# EAGLE design revC (EAGLE 6.4)
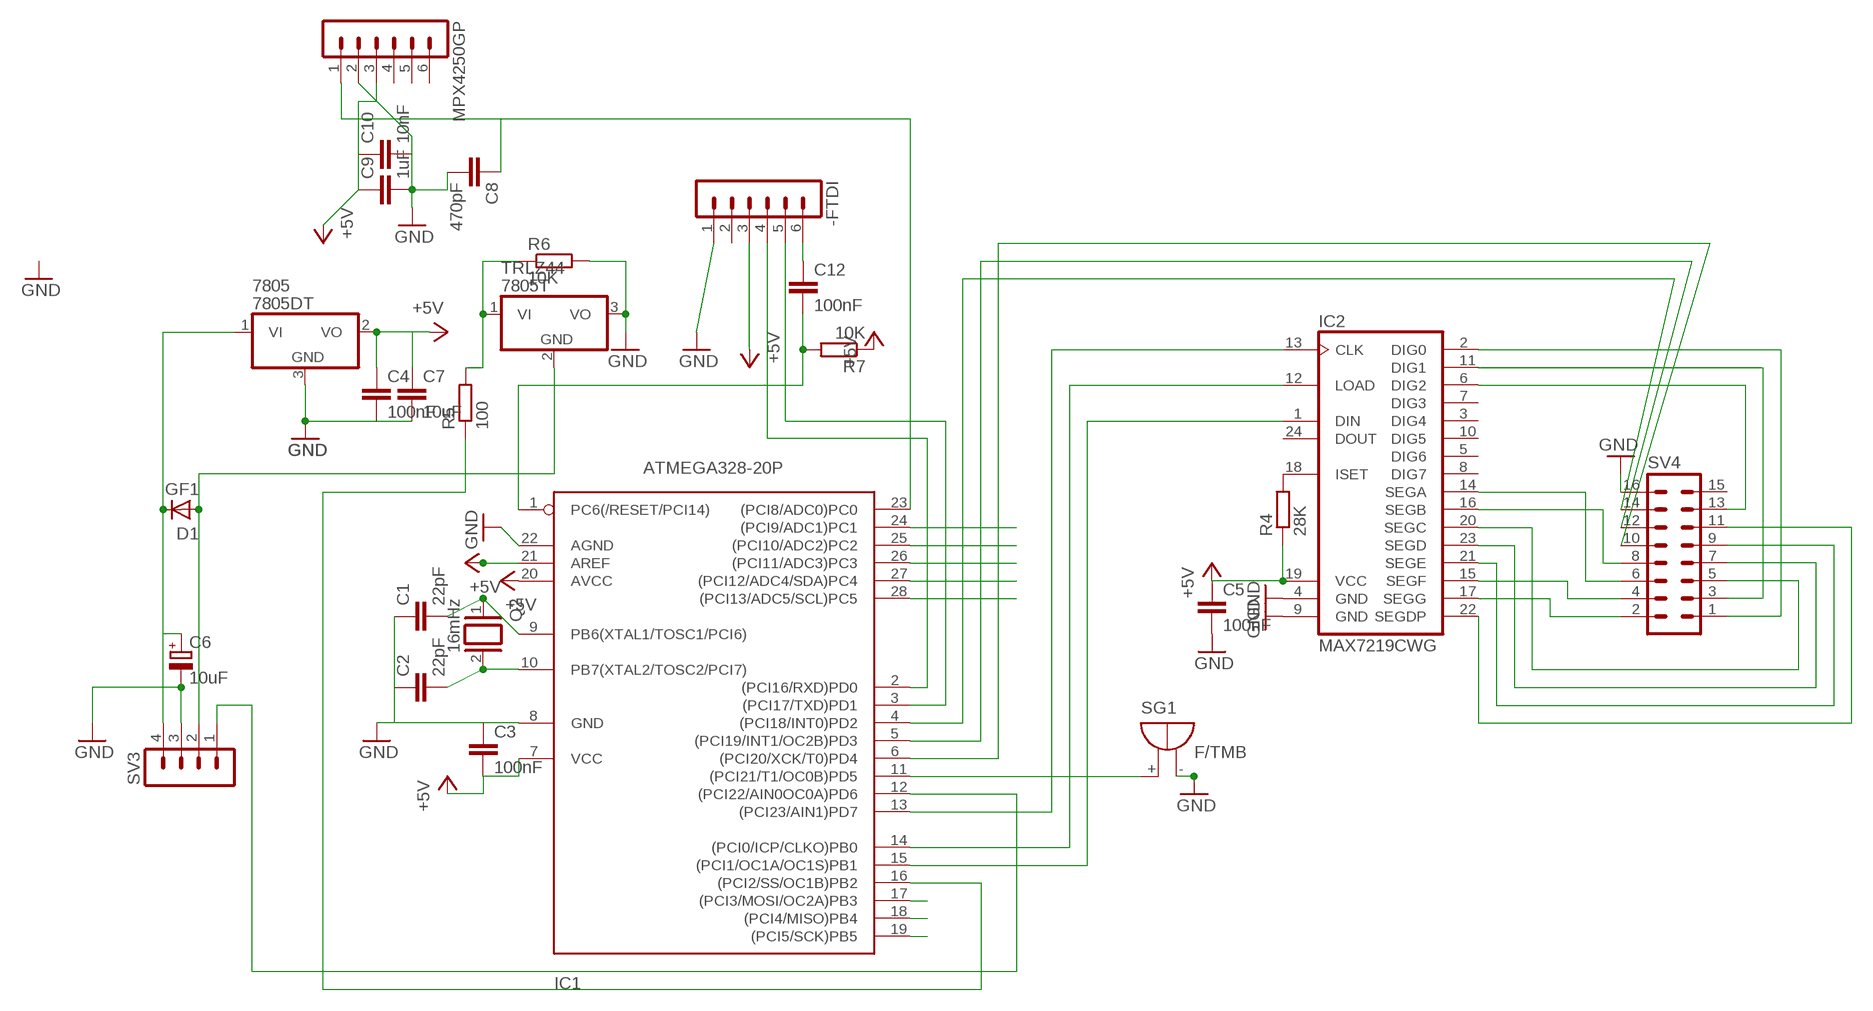
[diagram p0: schematic, sheet 1]

## Parts
7805  7805DT  [TO252]
-FTDI  MA06-1  [MA06-1]
C1  22pF  C-EUC0805  [C0805]
C2  22pF  C-EUC0805  [C0805]
C3  100nF  C-EUC0805  [C0805]
C4  100nF  C-EUC0805  [C0805]
C5  100nF  C-EUC0805  [C0805]
C6  10uF  CPOL-EUE2,5-6E  [E2,5-6E]
C7  10uF  C-EUC0805  [C0805]
C8  470pF  C-EUC0805  [C0805]
C9  1uF  C-EUC0805  [C0805]
C10  10nF  C-EUC0805  [C0805]
C12  100nF  C-EUC0805  [C0805]
D1  GF1  [SMA-DO214AC]
IC1  ATMEGA328-20P  ATMEGA168-20P  [DIL28-3]
IC2  MAX7219CWG  [MAX7219CWG]
MPX4250GP  MA06-1  [MA06-1]
Q2  16mHz  XTAL/S  [QS]
R4  28K  R-EU_R0805  [R0805]
R5  100  R-EU_R0805  [R0805]
R6  10K  R-EU_R0805  [R0805]
R7  10K  R-EU_R0805  [R0805]
SG1  F/TMB  [F/TMB]
SV3  MA04-1  [MA04-1]
SV4  MA08-2W  [MA08-2W]
TRLZ44  7805T  [TO220H]

## Nets
+5V: 7805.2(VO) -FTDI.3 C3.2 C4.1 C5.1 C7.1 C9.1 C10.1 IC1.7(VCC) IC1.20(AVCC) IC1.21(AREF) IC2.19(VCC) MPX4250GP.3 R4.1 R7.1
GND: 7805.3(GND) -FTDI.1 C1.1 C2.1 C3.1 C4.2 C5.2 C6.- C7.2 C8.2 C9.2 C10.2 IC1.8(GND) IC1.22(AGND) IC2.4(GND) IC2.9(GND) MPX4250GP.2 R6.2 SG1.- SV3.3 SV4.16 TRLZ44.3(VO)
N$1: C1.2 IC1.9(PB6(XTAL1/TOSC1/PCI6)) Q2.1
N$2: R5.2 R6.1 TRLZ44.1(VI)
N$3: IC1.15((PCI1/OC1A/OC1S)PB1) IC2.1(DIN)
N$4: IC2.6(DIG2) SV4.13
N$5: IC2.11(DIG1) SV4.3
N$6: IC2.22(SEGDP) SV4.11
N$7: IC2.21(SEGE) SV4.9
N$8: C8.1 IC1.23((PCI8/ADC0)PC0) MPX4250GP.1
N$9: IC2.23(SEGD) SV4.7
N$10: IC2.20(SEGC) SV4.5
N$11: IC2.2(DIG0) SV4.1
N$12: IC2.17(SEGG) SV4.2
N$13: IC2.15(SEGF) SV4.4
N$14: IC2.14(SEGA) SV4.6
N$15: IC2.18(ISET) R4.2
N$16: IC1.16((PCI2/SS/OC1B)PB2) R5.1
N$17: IC1.14((PCI0/ICP/CLKO)PB0) IC2.12(LOAD)
N$18: IC1.13((PCI23/AIN1)PD7) IC2.13(CLK)
N$19: IC1.4((PCI18/INT0)PD2) SV4.14
N$20: IC1.5((PCI19/INT1/OC2B)PD3) SV4.12
N$21: IC1.6((PCI20/XCK/T0)PD4) SV4.10
N$22: IC1.11((PCI21/T1/OC0B)PD5) SG1.+
N$24: -FTDI.4 IC1.2((PCI16/RXD)PD0)
N$25: -FTDI.5 IC1.3((PCI17/TXD)PD1)
N$26: 7805.1(VI) C6.+ D1.K(C) SV3.4
N$27: C2.2 IC1.10(PB7(XTAL2/TOSC2/PCI7)) Q2.2
N$28: D1.A SV3.2 TRLZ44.2(GND)
N$29: IC1.12((PCI22/AIN0OC0A)PD6) SV3.1
N$30: IC2.16(SEGB) SV4.8
N$33: IC1.18((PCI4/MISO)PB4)
N$34: C12.2 IC1.1(PC6(/RESET/PCI14)) R7.2
N$35: -FTDI.6 C12.1
N$192: IC1.24((PCI9/ADC1)PC1)
N$193: IC1.25((PCI10/ADC2)PC2)
N$194: IC1.26((PCI11/ADC3)PC3)
N$195: IC1.27((PCI12/ADC4/SDA)PC4)
N$196: IC1.28((PCI13/ADC5/SCL)PC5)
N$197: IC1.17((PCI3/MOSI/OC2A)PB3)
N$199: IC1.19((PCI5/SCK)PB5)
Unconnected: -FTDI.2 IC2.3(DIG4) IC2.5(DIG6) IC2.7(DIG3) IC2.8(DIG7) IC2.10(DIG5) IC2.24(DOUT) MPX4250GP.4 MPX4250GP.5 MPX4250GP.6 SV4.15

## Library data of the parts
7805 TRLZ44 = linear:78*: Positive VOLTAGE REGULATOR Source: http://cache.national.com/ds/LM/LM78L05.pdf http://www.fairchildsemi.com/ds/LM/LM7805.pdf; OC_FARNELL: unknown
-FTDI MPX4250GP = con-lstb:MA06-1: PIN HEADER; OC_FARNELL: unknown; OC_NEWARK: unknown
C1 C2 = resistor:C-EU: CAPACITOR, European symbol; MF: MURATA; MPN: ERB21B5C2D220JDX1L; OC_FARNELL: 1294526
C3-C5 C7-C10 C12 = resistor:C-EU: CAPACITOR, European symbol; MF: KEMET; MPN: C0805X104K5RACTU; OC_FARNELL: 1414041
C6 = resistor:CPOL-EU: POLARIZED CAPACITOR, European symbol
D1 = diode:GF1: DIODE
IC1 = adafruit:ATMEGA168*P: MICROCONTROLLER 16 kBytes FLASH 1 kBytes SRAM 512 Bytes EEPROM USART 8-channel 10 bit ADC; OC_FARNELL: unknown
IC2 = Custom:MAX7219CWG
Q2 = special:XTAL/S: CRYSTAL; MF: EUROQUARTZ; MPN: 16.000MHZ HC49/4H/30/50/40/18PF/ATF; OC_FARNELL: 1640875
R4-R7 = resistor:R-EU_: RESISTOR, European symbol
SG1 = buzzer:F/TMB: BUZZER Source: Buerklin; OC_FARNELL: unknown; OC_NEWARK: unknown
SV3 = con-lstb:MA04-1: PIN HEADER; OC_FARNELL: unknown; OC_NEWARK: unknown
SV4 = con-lstb:MA08-2W: PIN HEADER; OC_FARNELL: unknown; OC_NEWARK: unknown

## Board
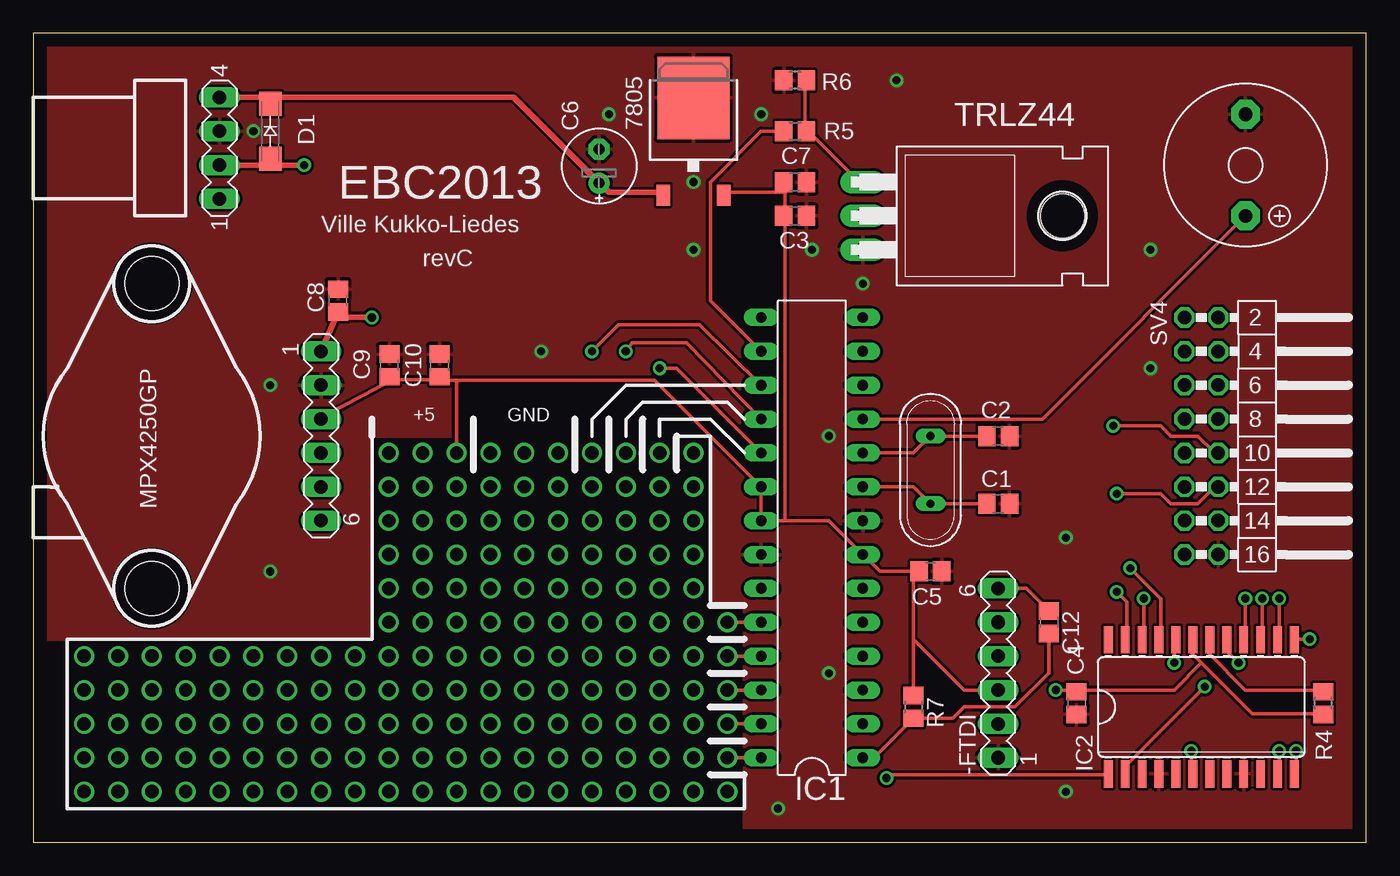
[diagram p1: board, top side]
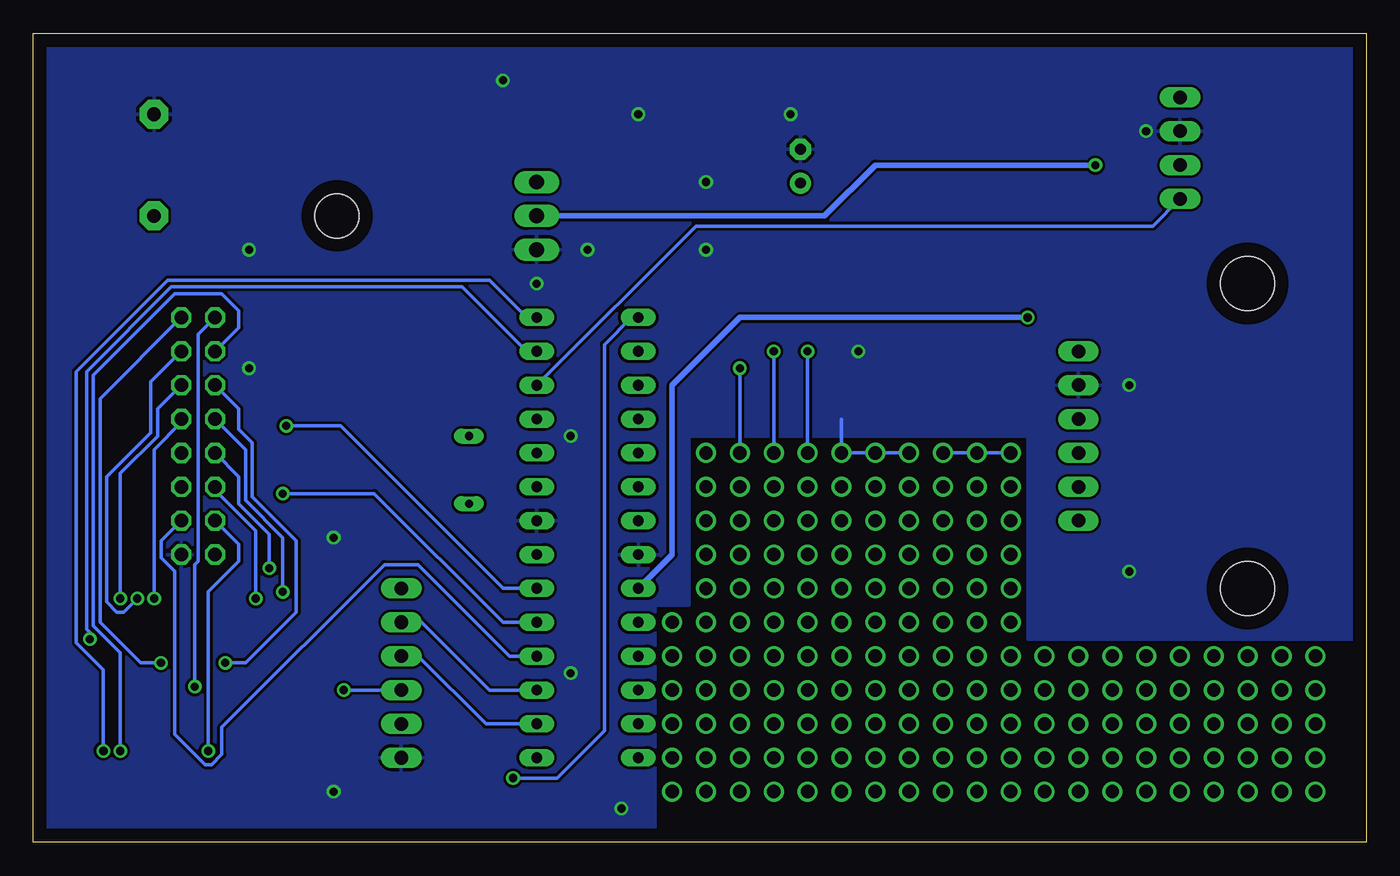
[diagram p2: board, bottom side, seen from below]

Size 100 x 60.68 mm. Coordinates in mm from the lower left corner, seen from the top.
Outline: 0,0 100,0 100,60.68 0,60.68 0,0
Copper layers (1*16): Top 0.035mm / dielectric 1.5mm / Bottom 0.035mm
Design rules "default": minimum track width 10mil, minimum drill 24mil, track to track 8mil, track to pad 8mil, pad to pad 8mil, via to via 8mil, smd to smd 8mil, copper to edge 40mil, drill to drill 8mil, minimum pad ring 10mil, minimum via ring 8mil, stop-mask expansion 4mil, vias tented up to drill 0mil, thermal gap 10mil
Holes 4.06 mm at 8.89,41.91 8.89,19.05

### Footprints (pad centres in the part's own frame; a part is rotated, then mirrored left to right if it is on the bottom)
TO252 = smd 1 x 1.6: 1 -2.28,-4.8; 2 2.28,-4.8 | smd 5.4 x 6.2: 3 0,2.5
MA06-1 = drill 1.016 long: 1 -6.35,0; 2 -3.81,0; 3 -1.27,0; 4 1.27,0; 5 3.81,0; 6 6.35,0
C0805 = smd 1.3 x 1.5: 1 -0.85,0; 2 0.85,0
E2,5-6E = drill 0.813 pad 1.575: + -1.27,0 | drill 0.813 pad 1.575 octagon: - 1.27,0
SMA-DO214AC = smd 1.8 x 1.7: A -2.05,0; K 2.05,0
DIL28-3 = drill 0.813 long: 1 -16.51,-3.81; 2 -13.97,-3.81; 3 -11.43,-3.81; 4 -8.89,-3.81; 5 -6.35,-3.81; 6 -3.81,-3.81; 7 -1.27,-3.81; 8 1.27,-3.81; 9 3.81,-3.81; 10 6.35,-3.81; 11 8.89,-3.81; 12 11.43,-3.81; 13 13.97,-3.81; 14 16.51,-3.81; 15 16.51,3.81; 16 13.97,3.81; 17 11.43,3.81; 18 8.89,3.81; 19 6.35,3.81; 20 3.81,3.81; 21 1.27,3.81; 22 -1.27,3.81; 23 -3.81,3.81; 24 -6.35,3.81; 25 -8.89,3.81; 26 -11.43,3.81; 27 -13.97,3.81; 28 -16.51,3.81
MAX7219CWG = smd 0.66 x 2.032: 1 -6.985,-5.029; 2 -5.715,-5.029; 3 -4.445,-5.029; 4 -3.175,-5.029; 5 -1.905,-5.029; 6 -0.635,-5.029; 7 0.635,-5.029; 8 1.905,-5.029; 9 3.175,-5.029; 10 4.445,-5.029; 11 5.715,-5.029; 12 6.985,-5.029; 13 6.985,5.029; 14 5.715,5.029; 15 4.445,5.029; 16 3.175,5.029; 17 1.905,5.029; 18 0.635,5.029; 19 -0.635,5.029; 20 -1.905,5.029; 21 -3.175,5.029; 22 -4.445,5.029; 23 -5.715,5.029; 24 -6.985,5.029
QS = drill 0.61 long: 1 -2.54,0; 2 2.54,0
R0805 = smd 1.3 x 1.5: 1 -0.85,0; 2 0.85,0
F/TMB = drill 1.016 pad 2.159 octagon: + 3.81,0; - -3.81,0
MA04-1 = drill 1.016 long: 1 -3.81,0; 2 -1.27,0; 3 1.27,0; 4 3.81,0
MA08-2W = drill 1.016 octagon: 1 -8.89,-1.27; 2 -8.89,1.27; 3 -6.35,-1.27; 4 -6.35,1.27; 5 -3.81,-1.27; 6 -3.81,1.27; 7 -1.27,-1.27; 8 -1.27,1.27; 9 1.27,-1.27; 10 1.27,1.27; 11 3.81,-1.27; 12 3.81,1.27; 13 6.35,-1.27; 14 6.35,1.27; 15 8.89,-1.27; 16 8.89,1.27
TO220H = drill 1.118 long: 1 -2.54,-10.16; 2 0,-10.16; 3 2.54,-10.16 | hole 3.302: 0,4.826

### Placement (x,y rotation side)
7805  49.53,53.34 0 top
-FTDI  72.39,12.7 90 top
C1  72.39,25.4 180 top
C2  72.39,30.48 180 top
C3  57.15,46.99 180 top
C4  78.26,10.45 270 top
C5  67.31,20.32 0 top
C6  42.45,50.72 90 top
C7  57.15,49.53 0 top
C8  22.86,40.64 90 top
C9  26.72,35.77 90 top
C10  30.48,35.77 90 top
C12  76.2,16.51 270 top
D1  17.78,53.34 90 top
IC1  58.42,22.86 90 top
IC2  87.63,10.16 0 top
MPX4250GP  21.59,30.48 270 top
Q2  67.31,27.94 90 top
R4  96.78,10.44 90 top
R5  57.15,53.34 0 top
R6  57.15,57.15 180 top
R7  66.04,10.16 270 top
SG1  90.95,50.8 270 top
SV3  13.97,52.07 90 top
SV4  87.63,30.48 270 top
TRLZ44  72.39,46.99 270 top

### Tracks (layer width: path | path; a pad name or v marks a point on that pad's centre or on a via)
+5V  (via drill 0.61, 1)
  Top 0.254: MPX4250GP.3 21.84,32 26.67,34.54 26.67,34.7 | 56.39,48.77 56.39,49.53 C7.1 | 56.39,48.77 56.39,46.99 | 56.39,48.77 51.82,48.77 7805.2 | 66.04,20.32 63.5,20.32 IC1.7 59.69,24.13 56.39,24.13 | 56.39,24.13 IC1.21 IC1.20 46.62,34.66 31.75,34.66 | 56.39,24.13 56.39,46.99 | 56.39,46.99 C3.2 | 31.75,34.66 30.51,34.66 30.47,34.7 | 30.47,34.7 26.67,34.7 | 26.67,34.7 26.63,34.7 | C10.1 30.48,34.8 30.47,34.7 | 26.67,34.8 C9.1 26.67,34.7 | v31.75,29.21 31.75,34.66 | v76.71,11.43 78.23,11.43 C4.1 78.49,11.43 85.6,11.43 87.63,13.46 | 87.63,13.46 86.87,14.22 86.87,14.99 IC2.19 | 87.63,13.46 91.44,9.65 96.77,9.65 R4.1 | -FTDI.3 69.85,11.43 66.04,15.24 | 66.04,15.24 66.04,20.32 | 66.04,20.32 C5.1 | R7.1 66.04,15.24
  Bottom 0.254: -FTDI.3 v76.71,11.43 | v26.67,29.21 v29.21,29.21 v31.75,29.21
GND  (via drill 0.61, 1)
  Bottom 0.254: 39.37,31.75 v39.37,29.21 v36.83,29.21 v34.29,29.21
  other vias: 54.61,54.61 43.18,54.61 64.77,57.15 58.42,44.45 62.23,41.91 16.51,53.34 49.53,49.53 49.53,44.45 17.78,34.29 17.78,20.32 38.1,36.83 55.88,2.54 59.69,12.7 59.69,30.48 83.82,44.45 83.82,35.56 77.47,22.86 77.47,3.81
  pour Bottom: -1.27,15.24 25.4,15.24 25.4,30.48 50.8,30.48 50.8,17.78 53.34,17.78 53.34,-1.27 101.6,-1.27 101.6,63.5 -1.27,63.5
  pour Top: -1.27,15.24 25.4,15.24 25.4,30.48 50.8,30.48 50.8,17.78 53.34,17.78 53.34,-1.27 101.6,-1.27 101.6,63.5 -1.27,63.5
N$1
  Top 0.254: C1.2 Q2.1 66.04,26.67 IC1.9
N$2
  Top 0.254: R6.1 57.91,57.15 57.91,53.34 R5.2 58.17,53.34 61.98,49.53 TRLZ44.1
N$3  (via drill 0.61)
  Top 0.254: v64.01,4.83 64.26,5.08 80.52,5.08 IC2.1
  Bottom 0.254: v64.01,4.83 60.71,4.83 57.15,8.38 57.15,37.34 55.12,39.37 IC1.15
N$4  (via drill 0.61)
  Top 0.254: v86.87,6.86 86.87,5.33 IC2.6
  Bottom 0.254: v86.87,6.86 86.87,18.8 84.58,21.08 84.58,22.35 SV4.13
N$5  (via drill 0.61)
  Top 0.254: v93.47,6.86 93.47,5.33 IC2.11
  Bottom 0.254: v93.47,6.86 93.47,14.22 95.5,16.26 95.5,35.05 89.41,41.15 85.85,41.15 84.58,39.88 84.58,38.61 SV4.3
N$6  (via drill 0.61)
  Top 0.254: v83.31,18.29 83.31,15.24 IC2.22
  Bottom 0.254: v83.31,18.29 83.31,23.37 86.36,26.42 SV4.11
N$7  (via drill 0.61)
  Top 0.254: v82.3,20.57 84.58,18.29 84.58,15.24 IC2.21
  Bottom 0.254: v82.3,20.57 82.3,23.11 84.58,25.4 84.58,27.43 SV4.9
N$8  (via drill 0.61)
  Top 0.406: v25.4,39.37 23.28,39.37 C8.1 MPX4250GP.1
  Bottom 0.406: IC1.23 52.07,21.59 52.07,34.29 46.99,39.37 v25.4,39.37
N$9  (via drill 0.61)
  Top 0.254: v81.28,18.8 82.04,18.03 82.04,15.24 IC2.23
  Bottom 0.254: v81.28,18.8 81.28,22.86 84.07,25.65 84.07,29.46 SV4.7
N$10  (via drill 0.61)
  Top 0.254: v85.6,13.46 85.6,14.99 IC2.20
  Bottom 0.254: v85.6,13.46 84.07,13.46 80.26,17.27 80.26,22.61 83.57,25.91 83.57,29.97 84.58,30.99 84.58,32.51 SV4.5
N$11  (via drill 0.61)
  Top 0.254: v87.88,11.68 82.04,5.84 82.04,5.33 IC2.2
  Bottom 0.254: v87.88,11.68 87.88,20.83 87.63,21.08 87.63,38.1 SV4.1
N$12  (via drill 0.61)
  Top 0.254: v90.42,13.46 89.66,14.22 89.66,14.99 IC2.17
  Bottom 0.254: v90.42,13.46 91.95,13.46 95,16.51 95,33.27 SV4.2
N$13  (via drill 0.61)
  Top 0.254: v92.2,18.29 92.2,15.24 IC2.15
  Bottom 0.254: v92.2,18.29 93.22,17.27 93.73,17.27 94.49,18.03 94.49,27.43 91.19,30.73 91.19,34.54 SV4.4
N$14  (via drill 0.61)
  Top 0.254: v93.47,18.29 93.47,15.24 IC2.14
  Bottom 0.254: v93.47,18.29 93.47,27.69 90.68,30.48 90.68,32.51 SV4.6
N$15
  Top 0.254: R4.2 96.77,11.43 90.93,11.43 88.14,14.22 88.14,14.99 IC2.18
N$16
  Top 0.254: R5.1 54.61,53.34 50.8,49.53 50.8,40.64 IC1.16
N$17  (via drill 0.61)
  Top 0.254: v94.74,6.86 94.74,5.33 IC2.12
  Bottom 0.254: v94.74,6.86 94.74,12.95 96.77,14.99 96.77,35.31 89.92,42.16 65.79,42.16 62.99,39.37 IC1.14
N$18  (via drill 0.61)
  Top 0.254: v95.76,15.24 94.74,15.24 IC2.13
  Bottom 0.254: v95.76,15.24 95.76,15.75 96.01,16 96.01,35.31 89.66,41.66 67.82,41.66 62.99,36.83 IC1.13
N$19
  Bottom 0.254: IC1.4 64.26,13.97 71.12,20.83 73.66,20.83 85.85,8.64 85.85,6.6 86.61,5.84 87.12,5.84 89.41,8.13 89.41,20.32 90.42,21.34 90.42,22.61 SV4.14
N$20  (via drill 0.61)
  Top 0.254: v81.28,26.16 84.58,26.16 85.34,25.4 87.38,25.4 88.65,26.67 SV4.12
  Bottom 0.254: IC1.5 64.77,16.51 74.42,26.16 v81.28,26.16
N$21  (via drill 0.61)
  Top 0.254: v81.03,31.24 84.58,31.24 85.34,30.48 87.38,30.48 88.65,29.21 SV4.10
  Bottom 0.254: IC1.6 64.77,19.05 76.96,31.24 v81.03,31.24
N$22
  Top 0.254: IC1.11 75.69,31.75 90.93,46.99 SG1.+
N$24
  Bottom 0.254: IC1.2 66.04,8.89 71.12,13.97 -FTDI.4
N$25
  Bottom 0.254: IC1.3 65.79,11.43 70.87,16.51 -FTDI.5
N$26
  Top 0.254: SV3.4 14.22,55.63 | 47.24,48.77 7805.1 | 42.67,49.28 C6.+ 42.42,49.53 42.4,49.51 | 17.78,55.37 D1.K 17.78,55.88
  Top 0.406: 47.24,48.77 43.18,48.77 42.67,49.28 | 42.49,49.42 42.4,49.51 36.04,55.88 17.78,55.88 SV3.4
N$27
  Top 0.254: C2.2 Q2.2 66.04,29.21 IC1.10
N$28  (via drill 0.61)
  Top 0.254: SV3.2 14.22,51.05 | 17.78,51.05 17.78,51.23
  Top 0.406: 17.78,50.8 SV3.2 | 17.78,50.8 17.78,51.23 | 17.78,51.23 17.92,51.37 | 17.92,51.37 | 17.92,51.37 17.87,51.32 17.92,51.32 | v20.32,50.8 17.78,50.8 | 17.78,51.23 D1.A 17.78,52.07
  Bottom 0.406: TRLZ44.2 40.64,46.99 36.83,50.8 v20.32,50.8
N$29
  Bottom 0.254: IC1.12 50.29,46.23 16,46.23 SV3.1
N$30  (via drill 0.61)
  Top 0.254: v90.93,18.29 90.93,15.24 IC2.16
  Bottom 0.254: v90.93,18.29 90.93,29.46 88.9,31.5 SV4.8
N$31  (via drill 1)
  other vias: 49.53,29.21
N$32  (via drill 1)
  other vias: 39.37,26.67
N$33  (via drill 0.61, 1)
  Top 0.254: IC1.18 49,37.47 44.92,37.47 v44.45,36.83
  Bottom 0.254: v44.45,36.83 v44.45,29.21
N$34
  Top 0.254: IC1.1 63.08,6.35 R7.2 69,9.31 69.85,10.16 73.66,10.16 76.2,12.7 C12.2
N$35
  Top 0.254: C12.1 74.51,19.05 -FTDI.6
N$41  (via drill 1)
  other vias: 49.53,26.67
N$42  (via drill 1)
  other vias: 46.99,26.67
N$43  (via drill 1)
  other vias: 44.45,26.67
N$44  (via drill 1)
  other vias: 41.91,26.67
N$46  (via drill 1)
  other vias: 36.83,26.67
N$47  (via drill 1)
  other vias: 34.29,26.67
N$48  (via drill 1)
  other vias: 31.75,26.67
N$49  (via drill 1)
  other vias: 29.21,26.67
N$50  (via drill 1)
  other vias: 26.67,26.67
N$51  (via drill 1)
  other vias: 49.53,24.13
N$52  (via drill 1)
  other vias: 46.99,24.13
N$53  (via drill 1)
  other vias: 44.45,24.13
N$54  (via drill 1)
  other vias: 41.91,24.13
N$55  (via drill 1)
  other vias: 39.37,24.13
N$56  (via drill 1)
  other vias: 36.83,24.13
N$57  (via drill 1)
  other vias: 34.29,24.13
N$58  (via drill 1)
  other vias: 31.75,24.13
N$59  (via drill 1)
  other vias: 29.21,24.13
N$60  (via drill 1)
  other vias: 26.67,24.13
N$61  (via drill 1)
  other vias: 49.53,21.59
N$62  (via drill 1)
  other vias: 46.99,21.59
N$63  (via drill 1)
  other vias: 44.45,21.59
N$64  (via drill 1)
  other vias: 41.91,21.59
N$65  (via drill 1)
  other vias: 39.37,21.59
N$66  (via drill 1)
  other vias: 36.83,21.59
N$67  (via drill 1)
  other vias: 34.29,21.59
N$68  (via drill 1)
  other vias: 31.75,21.59
N$69  (via drill 1)
  other vias: 29.21,21.59
N$70  (via drill 1)
  other vias: 26.67,21.59
N$71  (via drill 1)
  other vias: 49.53,19.05
N$72  (via drill 1)
  other vias: 46.99,19.05
N$73  (via drill 1)
  other vias: 44.45,19.05
N$74  (via drill 1)
  other vias: 41.91,19.05
N$75  (via drill 1)
  other vias: 39.37,19.05
N$76  (via drill 1)
  other vias: 36.83,19.05
N$77  (via drill 1)
  other vias: 34.29,19.05
N$78  (via drill 1)
  other vias: 31.75,19.05
N$79  (via drill 1)
  other vias: 29.21,19.05
N$80  (via drill 1)
  other vias: 26.67,19.05
N$81  (via drill 1)
  other vias: 49.53,16.51
N$82  (via drill 1)
  other vias: 46.99,16.51
N$83  (via drill 1)
  other vias: 44.45,16.51
N$84  (via drill 1)
  other vias: 41.91,16.51
N$85  (via drill 1)
  other vias: 39.37,16.51
N$86  (via drill 1)
  other vias: 36.83,16.51
N$87  (via drill 1)
  other vias: 34.29,16.51
N$88  (via drill 1)
  other vias: 31.75,16.51
N$89  (via drill 1)
  other vias: 29.21,16.51
N$90  (via drill 1)
  other vias: 26.67,16.51
N$91  (via drill 1)
  other vias: 49.53,13.97
N$92  (via drill 1)
  other vias: 46.99,13.97
N$93  (via drill 1)
  other vias: 44.45,13.97
N$94  (via drill 1)
  other vias: 41.91,13.97
N$95  (via drill 1)
  other vias: 39.37,13.97
N$96  (via drill 1)
  other vias: 36.83,13.97
N$97  (via drill 1)
  other vias: 34.29,13.97
N$98  (via drill 1)
  other vias: 31.75,13.97
N$99  (via drill 1)
  other vias: 29.21,13.97
N$100  (via drill 1)
  other vias: 26.67,13.97
N$101  (via drill 1)
  other vias: 49.53,11.43
N$102  (via drill 1)
  other vias: 46.99,11.43
N$103  (via drill 1)
  other vias: 44.45,11.43
N$104  (via drill 1)
  other vias: 41.91,11.43
N$105  (via drill 1)
  other vias: 39.37,11.43
N$106  (via drill 1)
  other vias: 36.83,11.43
N$107  (via drill 1)
  other vias: 34.29,11.43
N$108  (via drill 1)
  other vias: 31.75,11.43
N$109  (via drill 1)
  other vias: 29.21,11.43
N$110  (via drill 1)
  other vias: 26.67,11.43
N$111  (via drill 1)
  other vias: 49.53,8.89
N$112  (via drill 1)
  other vias: 46.99,8.89
N$113  (via drill 1)
  other vias: 44.45,8.89
N$114  (via drill 1)
  other vias: 41.91,8.89
N$115  (via drill 1)
  other vias: 39.37,8.89
N$116  (via drill 1)
  other vias: 36.83,8.89
N$117  (via drill 1)
  other vias: 34.29,8.89
N$118  (via drill 1)
  other vias: 31.75,8.89
N$119  (via drill 1)
  other vias: 29.21,8.89
N$120  (via drill 1)
  other vias: 26.67,8.89
N$121  (via drill 1)
  other vias: 49.53,6.35
N$122  (via drill 1)
  other vias: 46.99,6.35
N$123  (via drill 1)
  other vias: 44.45,6.35
N$124  (via drill 1)
  other vias: 41.91,6.35
N$125  (via drill 1)
  other vias: 39.37,6.35
N$126  (via drill 1)
  other vias: 36.83,6.35
N$127  (via drill 1)
  other vias: 34.29,6.35
N$128  (via drill 1)
  other vias: 31.75,6.35
N$129  (via drill 1)
  other vias: 29.21,6.35
N$130  (via drill 1)
  other vias: 26.67,6.35
N$131  (via drill 1)
  other vias: 49.53,3.81
N$132  (via drill 1)
  other vias: 46.99,3.81
N$133  (via drill 1)
  other vias: 44.45,3.81
N$134  (via drill 1)
  other vias: 41.91,3.81
N$135  (via drill 1)
  other vias: 39.37,3.81
N$136  (via drill 1)
  other vias: 36.83,3.81
N$137  (via drill 1)
  other vias: 34.29,3.81
N$138  (via drill 1)
  other vias: 31.75,3.81
N$139  (via drill 1)
  other vias: 29.21,3.81
N$140  (via drill 1)
  other vias: 26.67,3.81
N$145  (via drill 1)
  other vias: 52.07,3.81
N$146  (via drill 1)
  other vias: 24.13,3.81
N$147  (via drill 1)
  other vias: 21.59,3.81
N$148  (via drill 1)
  other vias: 19.05,3.81
N$149  (via drill 1)
  other vias: 16.51,3.81
N$150  (via drill 1)
  other vias: 13.97,3.81
N$151  (via drill 1)
  other vias: 11.43,3.81
N$152  (via drill 1)
  other vias: 8.89,3.81
N$153  (via drill 1)
  other vias: 6.35,3.81
N$154  (via drill 1)
  other vias: 3.81,3.81
N$155  (via drill 1)
  other vias: 3.81,6.35
N$156  (via drill 1)
  other vias: 3.81,8.89
N$157  (via drill 1)
  other vias: 3.81,11.43
N$158  (via drill 1)
  other vias: 3.81,13.97
N$159  (via drill 1)
  other vias: 6.35,13.97
N$160  (via drill 1)
  other vias: 8.89,13.97
N$161  (via drill 1)
  other vias: 11.43,13.97
N$162  (via drill 1)
  other vias: 13.97,13.97
N$163  (via drill 1)
  other vias: 16.51,13.97
N$164  (via drill 1)
  other vias: 19.05,13.97
N$165  (via drill 1)
  other vias: 21.59,13.97
N$166  (via drill 1)
  other vias: 24.13,13.97
N$167  (via drill 1)
  other vias: 6.35,11.43
N$168  (via drill 1)
  other vias: 6.35,8.89
N$169  (via drill 1)
  other vias: 6.35,6.35
N$170  (via drill 1)
  other vias: 8.89,6.35
N$171  (via drill 1)
  other vias: 8.89,8.89
N$172  (via drill 1)
  other vias: 8.89,11.43
N$173  (via drill 1)
  other vias: 11.43,11.43
N$174  (via drill 1)
  other vias: 13.97,11.43
N$175  (via drill 1)
  other vias: 16.51,11.43
N$176  (via drill 1)
  other vias: 19.05,11.43
N$177  (via drill 1)
  other vias: 21.59,11.43
N$178  (via drill 1)
  other vias: 24.13,11.43
N$179  (via drill 1)
  other vias: 24.13,8.89
N$180  (via drill 1)
  other vias: 24.13,6.35
N$181  (via drill 1)
  other vias: 21.59,6.35
N$182  (via drill 1)
  other vias: 19.05,6.35
N$183  (via drill 1)
  other vias: 16.51,6.35
N$184  (via drill 1)
  other vias: 13.97,6.35
N$185  (via drill 1)
  other vias: 11.43,6.35
N$186  (via drill 1)
  other vias: 11.43,8.89
N$187  (via drill 1)
  other vias: 13.97,8.89
N$188  (via drill 1)
  other vias: 16.51,8.89
N$189  (via drill 1)
  other vias: 19.05,8.89
N$190  (via drill 1)
  other vias: 21.59,8.89
N$192  (via drill 1)
  Top 0.254: IC1.24 v52.07,16.51
N$193  (via drill 1)
  Top 0.254: IC1.25 v52.07,13.97
N$194  (via drill 1)
  Top 0.254: IC1.26 v52.07,11.43
N$195  (via drill 1)
  Top 0.254: IC1.27 v52.07,8.89
N$196  (via drill 1)
  Top 0.254: IC1.28 v52.07,6.35
N$197  (via drill 0.61, 1)
  Top 0.254: IC1.17 49.97,38.81 43.89,38.81 v41.91,36.83
  Bottom 0.254: v41.91,36.83 v41.91,29.21
N$199  (via drill 0.61, 1)
  Top 0.254: IC1.19 48.26,35.56 v46.99,35.56
  Bottom 0.254: v46.99,29.21 v46.99,35.56

### Text on the board
tPlace: EBC2013 | Ville Kukko-Liedes | revC | +5 | GND